# Altium schematic sheet Sheet1.SchDoc
size A4; SheetNumber: 1; SheetTotal: 1
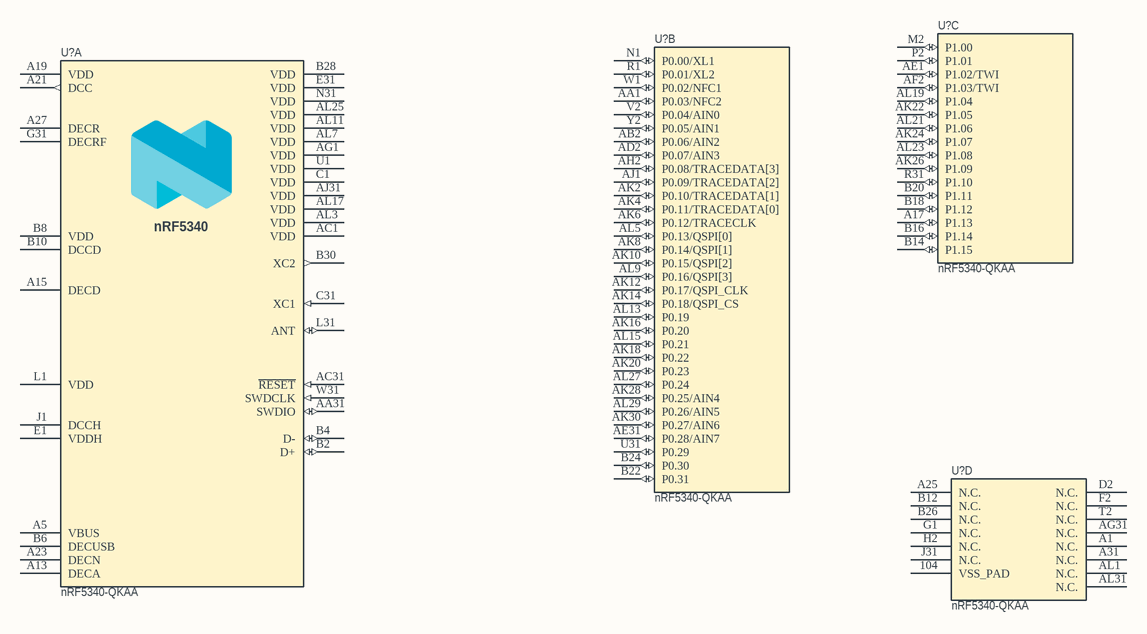
[diagram p0: Sheet1.SchDoc]

## Parts
(Parts that share a designator on the sheet are numbered #1, #2 ... from top to bottom, then left to right.)
U?#1  nRF5340-QKAA  [AQFN40P700X700X85_HS-99N]  (part C of 4)
U?#2  nRF5340-QKAA  [AQFN40P700X700X85_HS-99N]  (part B of 4)
U?#3  nRF5340-QKAA  [AQFN40P700X700X85_HS-99N]  (part A of 4)
U?#4  nRF5340-QKAA  [AQFN40P700X700X85_HS-99N]  (part D of 4)

## Nets

Not connected (* = marked no-connect by the designer): U?#1 A17(P1.13) AE1(P1.02/TWI) AF2(P1.03/TWI) AK22(P1.05) AK24(P1.07) AK26(P1.09) AL19(P1.04) AL21(P1.06) AL23(P1.08) B14(P1.15) B16(P1.14) B18(P1.12) B20(P1.11) M2(P1.00) P2(P1.01) R31(P1.10); U?#2 AA1(P0.03/NFC2) AB2(P0.06/AIN2) AD2(P0.07/AIN3) AE31(P0.28/AIN7) AH2(P0.08/TRACEDATA[3]) AJ1(P0.09/TRACEDATA[2]) AK2(P0.10/TRACEDATA[1]) AK4(P0.11/TRACEDATA[0]) AK6(P0.12/TRACECLK) AK8(P0.14/QSPI[1]) AK10(P0.15/QSPI[2]) AK12(P0.17/QSPI_CLK) AK14(P0.18/QSPI_CS) AK16(P0.20) AK18(P0.22) AK20(P0.23) AK28(P0.25/AIN4) AK30(P0.27/AIN6) AL5(P0.13/QSPI[0]) AL9(P0.16/QSPI[3]) AL13(P0.19) AL15(P0.21) AL27(P0.24) AL29(P0.26/AIN5) B22(P0.31) B24(P0.30) N1(P0.00/XL1) R1(P0.01/XL2) U31(P0.29) V2(P0.04/AIN0) W1(P0.02/NFC1) Y2(P0.05/AIN1); U?#3 A5(VBUS) A13(DECA) A15(DECD) A19(VDD) A21(DCC) A23(DECN) A27(DECR) AA31(SWDIO) AC1(VDD) AC31(~{RESET}) AG1(VDD) AJ31(VDD) AL3(VDD) AL7(VDD) AL11(VDD) AL17(VDD) AL25(VDD) B2(D+) B4(D-) B6(DECUSB) B8(VDD) B10(DCCD) B28(VDD) B30(XC2) C1(VDD) C31(XC1) E1(VDDH) E31(VDD) G31(DECRF) J1(DCCH) L1(VDD) L31(ANT) N31(VDD) U1(VDD) W31(SWDCLK); U?#4 104(VSS_PAD) A1(N.C.) A25(N.C.) A31(N.C.) AG31(N.C.) AL1(N.C.) AL31(N.C.) B12(N.C.) B26(N.C.) D2(N.C.) F2(N.C.) G1(N.C.) H2(N.C.) J31(N.C.) T2(N.C.)

## Notes on the sheet
- (in symbol nRF5340-QKAA, part A) nRF5340

## Library data of the parts
U?#1-U?#4 = nRF5340-QKAA: Multi-protocol Bluetooth Low Energy, IEEE 802.15.4, ANT and 2.4GHz proprietary system-on-chip; Pad Count: 98; Footprint Doc: AQFN-98; Value: nRF5340-QKAA; Component Class: nRF_Devices